# Altium project RF Transceiver.PrjPcb
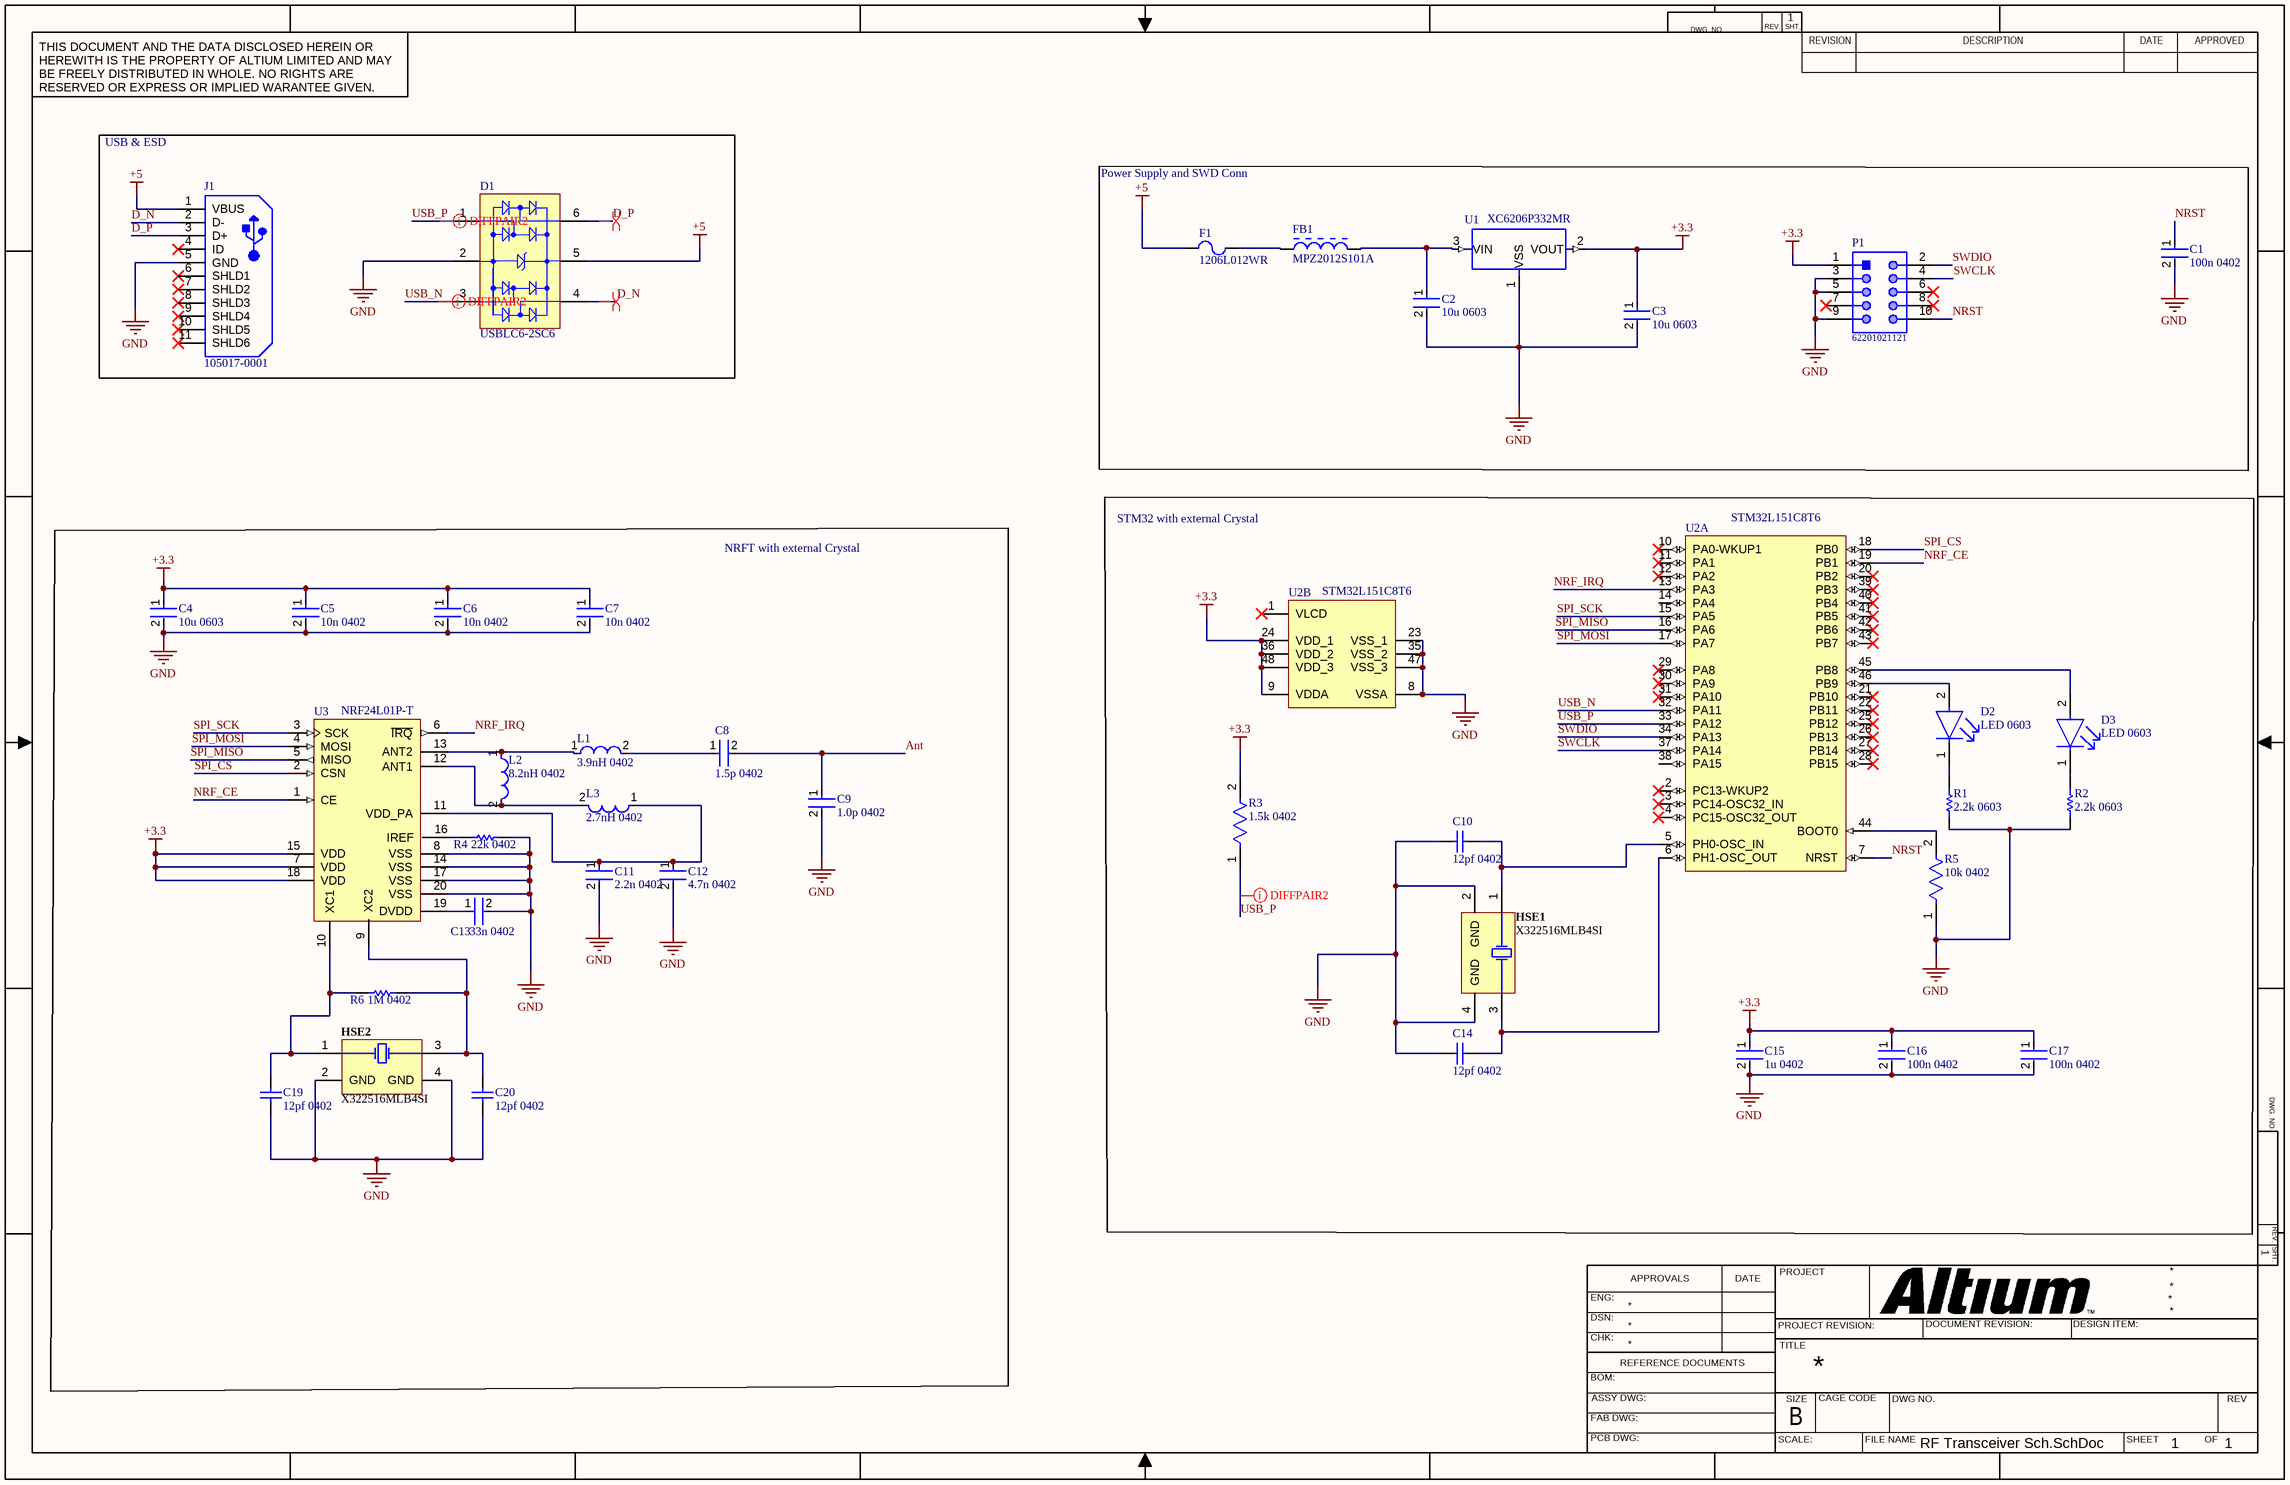
[diagram p0: RF Transceiver Sch.SchDoc]
1 sheet, 40 parts. Net scope: global (net labels, ports and power ports of the same name join across sheets).
Board file: RF Transceiver PCB.PcbDoc

## Sheet RF Transceiver Sch.SchDoc
size 431 x 279 mm; SheetNumber: 1; SheetTotal: 1

### Parts
C1  100n 0402  [FP-C0402-BB-MFG]
C2  10u 0603  [FP-GRM188-0_1-e0_2_0_55-IPC_A]
C3  10u 0603  [FP-GRM188-0_1-e0_2_0_55-IPC_A]
C4  10u 0603  [FP-GRM188-0_1-e0_2_0_55-IPC_A]
C5  10n 0402  [FP-C0402-BB-MFG]
C6  10n 0402  [FP-C0402-BB-MFG]
C7  10n 0402  [FP-C0402-BB-MFG]
C8  1.5p 0402  [FP-C0402-BB-MFG]
C9  1.0p 0402  [FP-C0402-BB-MFG]
C10  12pf 0402  [CAPC1005X55X25ML05T10]
C11  2.2n 0402  [FP-C0402-BB-MFG]
C12  4.7n 0402  [FP-C0402-BB-MFG]
C13  33n 0402  [FP-C0402-BB-MFG]
C14  12pf 0402  [CAPC1005X55X25ML05T10]
C15  1u 0402  [FP-GRM15-0_1-MFG]
C16  100n 0402  [FP-C0402-BB-MFG]
C17  100n 0402  [FP-C0402-BB-MFG]
C19  12pf 0402  [CAPC1005X55X25ML05T10]
C20  12pf 0402  [CAPC1005X55X25ML05T10]
D1  USBLC6-2SC6  [STM-SOT23-6L_V]
D2  LED 0603  [FP-LTST-C191TBKT-MFG]
D3  LED 0603  [FP-LTST-C191TBKT-MFG]
F1  1206L012WR  [LFUS-1206L012WR_V]
FB1  MPZ2012S101A  [TDK-MPZ2012S101A-2_V]
HSE1  X322516MLB4SI  [EPSON-TSX-3225_V]
HSE2  X322516MLB4SI  [EPSON-TSX-3225_V]
J1  105017-0001  [USB-MICRO-B_V]
L1  3.9nH 0402  [FP-LQW15AN_80-MFG]
L2  8.2nH 0402  [FP-LQW15AN_80-MFG]
L3  2.7nH 0402  [FP-LQW15AN_80-MFG]
P1  62201021121  [62201021121]
R1  2.2k 0603  [RESC1609X50X30NL10T20]
R2  2.2k 0603  [RESC1609X50X30NL10T20]
R3  1.5k 0402  [FP-CRCW0402-e3-IPC_B]
R4  22k 0402  [RESC1005X40X25NL05T05]
R5  10k 0402  [FP-CRCW0402-e3-IPC_B]
R6  1M 0402  [RESC1005X40X25NL05T05]
U1  XC6206P332MR  [SOT-23]
U2  STM32L151C8T6  [STM-LQFP48_L]  (parts A,B of 2)
U3  NRF24L01P-T  [NRSC-QFN-20_L]

### Blocks framed on the sheet
USB & ESD: D1 J1
Power Supply and SWD Conn: C1-C3 F1 FB1 P1 U1
NRFT with external Crystal: C4-C9 C11-C13 C19 C20 HSE2 L1-L3 R4 R6 U3
STM32 with external Crystal: C10 C14-C17 D2 D3 HSE1 R1-R3 R5 U2

### Nets
+3.3: C3.1 C4.1 C5.1 C6.1 C7.1 C15.1 C16.1 C17.1 P1.1 R3.2 U1.2(VOUT) U2.9(VDDA) U2.24(VDD_1) U2.36(VDD_2) U2.48(VDD_3) U3.7(VDD) U3.15(VDD) U3.18(VDD)
+5: D1.5(VBUS) F1.1 J1.1(VBUS)
GND: C1.2 C2.2 C3.2 C4.2 C5.2 C6.2 C7.2 C9.2 C10.1 C11.2 C12.2 C13.2 C14.1 C15.2 C16.2 C17.2 C19.1 C20.1 D1.2(GND) HSE1.2(GND) HSE1.4(GND) HSE2.2(GND) HSE2.4(GND) J1.5(GND) P1.3 P1.5 P1.9 R1.2 R2.2 R4.2 R5.1 U1.1(VSS) U2.8(VSSA) U2.23(VSS_1) U2.35(VSS_2) U2.47(VSS_3) U3.8(VSS) U3.14(VSS) U3.17(VSS) U3.20(VSS)
Ant: C8.2 C9.1
D_N: D1.4(I/O_3) J1.2(D-)
D_P: D1.6(I/O_4) J1.3(D+)
NRF_CE: U2.19(PB1) U3.1(CE)
NRF_IRQ: U2.13(PA3) U3.6(~{IRQ})
NRST: C1.1 P1.10 U2.7(NRST)
SPI_CS: U2.18(PB0) U3.2(CSN)
SPI_MISO: U2.16(PA6) U3.5(MISO)
SPI_MOSI: U2.17(PA7) U3.4(MOSI)
SPI_SCK: U2.15(PA5) U3.3(SCK)
SWCLK: P1.4 U2.37(PA14)
SWDIO: P1.2 U2.34(PA13)
USB_N: D1.3(I/O_2) U2.32(PA11)
USB_P: D1.1(I/O_1) R3.1 U2.33(PA12)
NetC2_1: C2.1 FB1.2 U1.3(VIN)
NetC8_1: C8.1 L1.2
NetC10_2: C10.2 HSE1.1(X1) U2.5(PH0-OSC_IN)
NetC11_1: C11.1 C12.1 L3.1 U3.11(VDD_PA)
NetC13_1: C13.1 U3.19(DVDD)
NetC14_2: C14.2 HSE1.3(X2) U2.6(PH1-OSC_OUT)
NetC19_2: C19.2 HSE2.1(X1) R6.1 U3.10(XC1)
NetC20_2: C20.2 HSE2.3(X2) R6.2 U3.9(XC2)
NetD2_1: D2.1(C) R1.1
NetD2_2: D2.2(A) U2.46(PB9)
NetD3_1: D3.1(C) R2.1
NetD3_2: D3.2(A) U2.45(PB8)
NetF1_2: F1.2 FB1.1
NetL1_1: L1.1 L2.1 U3.13(ANT2)
NetL2_2: L2.2 L3.2 U3.12(ANT1)
NetR4_1: R4.1 U3.16(IREF)
NetR5_2: R5.2 U2.44(BOOT0)

Not connected (* = marked no-connect by the designer): J1 4(ID)* 6(SHLD1)* 7(SHLD2)* 8(SHLD3)* 9(SHLD4)* 10(SHLD5)* 11(SHLD6)*; P1 6* 7* 8*; U2 1(VLCD)* 2(PC13-WKUP2)* 3(PC14-OSC32_IN)* 4(PC15-OSC32_OUT)* 10(PA0-WKUP1)* 11(PA1)* 12(PA2)* 14(PA4) 20(PB2)* 21(PB10)* 22(PB11)* 25(PB12)* 26(PB13)* 27(PB14)* 28(PB15)* 29(PA8)* 30(PA9)* 31(PA10)* 38(PA15) 39(PB3)* 40(PB4)* 41(PB5)* 42(PB6)* 43(PB7)*

### Layout directives
differential pair; differential pair class D: D_N, D_P
differential pair; differential pair class D2: USB_N, USB_P

### Notes on the sheet
- DWG. NO.
- REV.
- SHT.
- THIS DOCUMENT AND THE DATA DISCLOSED HEREIN OR HEREWITH IS THE PROPERTY OF ALTIUM LIMITED AND MAY BE FREELY DISTRIBUTED IN WHOLE. NO RIGHTS ARE RESERVED OR EXPRESS OR IMPLIED WARANTEE GIVEN.
- REVISION
- DESCRIPTION
- DATE
- APPROVED
- ENG:
- APPROVALS
- PROJECT
- DSN:
- CHK:
- REFERENCE DOCUMENTS
- PROJECT REVISION:
- TITLE
- DOCUMENT REVISION:
- DESIGN ITEM:
- BOM:
- FAB DWG:
- PCB DWG:
- ASSY DWG:
- SCALE:
- SIZE
- B
- CAGE CODE
- FILE NAME
- DWG NO.
- SHEET
- OF
- REV

### Library data of the parts
C1 C5-C9 C11-C13 C16 C17 = CMP-2008-02046-2: CAP CER 0.1UF 10V X5R 0402; Manufacturer: Kemet; Manufacturer Part Number: C0402C104K8PACTU; Material: Ceramic; Capacitance: 0.10 μF; Temperature Coefficient: 15%; Tolerance: 0.1; Value: 0.10 μF; Package: C0402-BB; Temperature: -55°C to +125°C; ComponentLink2Description: Datasheet; Temperature Characteristic: X5R; Device Class L1: Passive Components; Height: 0.55mm; Lead Free: Yes; ComponentLink2URL: https://content.kemet.com/datasheets/KEM_C1002_X7R_SMD.pdf; Device Class L2: Capacitors; Temperature Range Low: -55°C; Temperature Range High: +125°C; RoHS: TRUE; Octopart: https://octopart.com/c0402c104k8pactu-kemet-140039; Automotive: No; Mouser Description: Capacitor 100 nF 10 VDC 0402; Category: Cap; Voltage Rating: 10 V; Digikey Description: CAP CER 0.1UF 10V X5R 0402; Ipc Land Pattern Name: CAPC10050X50; Device Class L3: Ceramic Capacitors
C2-C4 = CMP-2006-02792-2: Chip Multilayer Ceramic Capacitors for General Purpose, 0603, 10uF, X5R, 15%, 20%, 6.3V; Packaging: Tape and Reel; Voltage Rating (DC): 6.3V; Width: 0.031inch; Termination: SMD/SMT; Dielectric: X5R; Package Quantity: 4000; Voltage Rating: 6.3V; Capacitance: 10uF; Case/Package: 0603; Min Operating Temperature: -55°C; Voltage: 6.3V; Length: 1.6mm; Thickness: 0.035inch; Lead Free: Lead Free; Depth: 0.8mm; Case Code (Imperial): 0603; Max Operating Temperature: 85°C; Material: Ceramic; Height: 0.8mm; Tolerance: 20%; Mount: Surface Mount; REACH SVHC: No SVHC; Radiation Hardening: No; Case Code (Metric): 1608
C10 C14 C19 C20 = CMP-2008-03945-1: Part Number: GRM1555C1H120GA01D; Manufacturer: Murata
C15 = CMP-2008-04556-2: CAP CER 1UF 10V X5R 0402; Manufacturer Part Number: GRM155R61A105KE15D; Manufacturer: Murata; Material: Ceramic; Tolerance: 10%; Temperature Coefficient: 15%; Octopart: https://octopart.com/grm155r61a105ke15d-murata-197442; Lead Free: Yes; ComponentLink2Description: Datasheet; Temperature: -55°C to +85°C; Temperature Range High: +85°C; Height: 0.55mm; Capacitance: 1uF; Ipc Land Pattern Name: CAPC10050X50; ComponentLink2URL: https://search.murata.co.jp/Ceramy/image/img/A01X/G101/ENG/GRM155R61A105KE15-01A.pdf; Temperature Range Low: -55°C; Device Class L2: Capacitors; Voltage Rating: 10V; RoHS: TRUE; Device Class L1: Passive Components; Device Class L3: Ceramic Capacitors; Temperature Characteristic: X5R; Mouser Description: 0402 1 uF 10 V ±10% Tolerance X5R Surface Mount Multilayer Ceramic Capacitor; Automotive: No; Package: GRM15-0.1; Digikey Description: CAP CER 1UF 10V X5R 0402; Value: 1uF; Category: Cap
D1 = CMP-2000-05378-1: Very low capacitance ESD protection, 3.5 pF, -40 to 125 degC, 6-Pin SOT23, RoHS, Tape and Reel; Manufacturer: STMicroelectronics; Polarity: Uni-Directional; Clamping Voltage: 17V; Rad Hardened: No; Product Height (mm): 1.3mm; Leakage Current (Max): 0.15uA; Product Length (mm): 3.05mm; Number of Elements: 1; Peak Pulse Current: 5A; Configuration: Dual; Reverse Breakdown Voltage: 6V; Working Voltage (Max): 5V; Capacitance Value: 3.5pF; Suppressor Type: DiodeArrays; Product Depth (mm): 1.75mm; Test Current (It): 1mA; Package / Case: SOT-23; Operating Temperature Max Deg. C: 125C; Package Description: 6-Pin Small Outline Transistor, Body 2.925 x 1.625 mm, Pitch 0.95 mm; Package Reference: SOT23-6L; Datasheet Version: Rev. 5, 10/2011; Operating Temperature Min Deg. C: -40C; Mounting Style: SurfaceMount; Direction Type: Uni-Directional; Mounting: SurfaceMount; Pin Count: 6; Leakage Current: 0.15uA; Packaging: TapeandReel; Operating Temperature Classification: Automotive; Clamping Voltage (Max): 17V; Manufacturer URL: http://www.st.com/; Reverse Stand-off Voltage: 5V; Datasheet URL: http://www.st.com/st-web-ui/static/active/en/resource/technical/document/datasheet/CD00050750.pdf; Working Voltage: 5V; Operating Temp Range: -40Cto125C
D2 D3 = CMP-22017-000008-1: LED BLUE CLEAR CHIP SMD; Lens Color: Colorless; Dominant Wavelength: 475nm; Forward Current: 20mA; Wavelength: 468nm; Viewing Angle: 130°; Power Dissipation: 76mW; Luminous Intensity: 180mcd; Reverse Voltage: 5V; Number of Elements: 1; Lens Style: Diffused; Forward Voltage: 3.8V; Max Power Dissipation: 75mW; Case Code (Metric): 1608; Packaging: Tape and Reel; Case/Package: 0603; Depth: 1.6mm; Mount: Surface Mount; Lead Free: Lead Free; Min Operating Temperature: -20°C; Lens Transparency: Clear; Illumination Color: Blue; Height: 0.55mm; Test Current: 20mA; Case Code (Imperial): 0603; Max Operating Temperature: 80°C; Number of Pins: 2; Length: 0.8mm; Radiation Hardening: No; Package Quantity: 1; Number of LEDs: 1; Width: 0.8mm; Color: Blue
F1 = CMP-2000-05470-1: POLY-FUSE(R) Resettable PTC, 30 V, -40 to 85 degC, 2-Pin SMD, RoHS, Tape and Reel; Manufacturer: Littelfuse; Hold Current [Ih]: 0.125A; Working Voltage-Max: 30V; Trip Current: 0.29A; Operating Temp Range: -40to+85°C; Package Reference: 1206; Package Description: 2-Pin Surface Mount Device, Body 3.2 x 1.65 mm; Mounting Technology: SurfaceMount; Manufacturer URL: http://www.littelfuse.com/; Datasheet URL: https://datasheet.ciiva.com/26787/1206l012wr-26787215.pdf; Size: 1206; Datasheet Version: 04/2012
FB1 = CMP-2000-05399-1: Chip Bead for Power Line, 100 Ohm, +/- 25%, 4 A, -55 to 125 degC, 0805 (2012 Metric), RoHS, Tape and Reel; Manufacturer: TDK; Maximum DC Resistance: 20mOhms; Test Frequency: 100MHz; Impedance: 100Ohms; Case Width: 1.25mm; Case Length: 2mm; Maximum DC Current: 4A; Case Height: 0.85mm; Package Reference: MPZ2012S101A-2; RoHS: Details; Tolerance: 25%; Operating Temperature Range: -55Cto+125C; Datasheet Version: Jul-13; Dimensions: 1.25mmWx2mmLx0.85mmH; Product: FerriteChipBeads; Termination Style: SMD/SMT; Datasheet URL: http://www.farnell.com/datasheets/1750041.pdf; Factory Pack Quantity: 4000; Brand: TDK; Packaging: Reel; Package Description: 2-Pin Surface Mount Device, Body 2 x 1.25 mm; Product Category: EMIFilterBeads,Chips&Arrays; Manufacturer URL: http://www.tdk.com/; Package / Case: 0805(2012metric)
HSE1 HSE2 = CMP-2000-07331-1: Crystal, 16 MHz, -40 to 85 degC, 4-Pin SMD, RoHS, Tape and Reel; Manufacturer: Epson; ESR: 60Ohms; Brand: EpsonTiming; Load Capacitance: 9pF; Frequency: 16MHz; Frequency Stability: 10PPM; Unit Weight: 0.000564oz; Drive Level: 200uW; Factory Pack Quantity: 250; Mounting Style: SMD/SMT; Packaging: Reel; Datasheet URL: https://support.epson.biz/td/api/doc_check.php?dl=brief_FA-238V_en.pdf; Datasheet Version: 12/2015; Package Reference: TSX-3225; Series: TSX-3225; Package / Case: 3.2mmx2.5mm; Package Description: 4-Pin Surface Mount Device, Body 3.2 x 2.5 mm; Type: Crystal; Height: 0.6mm; Manufacturer URL: https://www.eea.epson.com/; Operating Temperature Range: -20Cto+75C; Length: 3.2mm; Width: 2.5mm; RoHS: True; Mounting Technology: SurfaceMount; Termination Style: SMD/SMT; Product Category: Crystals; Tolerance: 10PPM
J1 = CMP-2000-05827-1: Micro-USB B Receptacle, Right Angle, Bottom Mount, Surface Mount, with Solder Tabs, -30 to 85 degC, 5-Pin USB, RoHS, Tape and Reel; Manufacturer: Molex; Featured Product: Micro-USBConnectorsUSBConnectors; Other Names: WM1399DKR; Package Version: Rev. F, 12/2012; Number of Contacts: 5; Connector Type: USB-microB; Catalog Drawings: 1050170001; 3D Model: 105017-0001.stp; Mating Products: WM17145-ND-CABLEMICROUSBBTOSTDA1.0MWM17147-ND-CABLEMICROUSBBTOSTDA2.0MWM17146-ND-CABLEMICROUSBBTOSTDA1.5M; PCN Assembly/Origin: ResinSupplier21/Oct/2015; Voltage - Max: 30V; Online Catalog: Molex-MicroUSB; Manufacturer URL: http://www.molex.com/; Package Description: 5-Leads USB, Micro B, Body 7.5 x 5 mm, Pitch 0.65 mm; Datasheet URL: http://www.molex.com/elqNow/elqRedir.htm?ref=http://www.molex.com/webdocs/datasheets/pdf/en-us/1050170001_IO_CONNECTORS.pdf; Ingress Protection: -; Datasheet Version: 03/2016; Mounting Type: BoardCutout,SurfaceMount,RightAngle; Circuits: 5; Standard Package: 1; Package Reference: MICRO-B; Package URL: http://www.molex.com/pdm_docs/sd/1050170001_sd.pdf; Category: Connectors,Interconnects; Series: -; RoHS Information: 1050170001CertofCompliance; Features: Shielded,SolderRetention; Family: USB,DVI,HDMIConnectors; Specifications: -; Gender: Receptacle; Packaging: Digi-Reel®; Mounting Technology: SurfaceMount
L1-L3 = CMP-06042-006817-1: Wire Wound RF Inductor for Automotive 3.4nH ±0.5nH 1950mA 0.03Ω 0402 (1005)
P1 = CMP-1502-00948-1: THT Vertical Pin Header WR-PHD, Pitch 1.27 mm, Dual Row, 10 pins; Manufacturer: Wurth Elektronik; Rated Current: 1A; Pin Number: 10; Working Voltage: 100VAC; Contact Resistance: 20mOhm; Withstanding Voltage: 500VAC; Pitch: 1.27mm; Gender: Male; Mounting Technology: THT; Manufacturer URL: http://www.we-online.de; Package Reference: 62201021121; Row Number: Dual; Datasheet URL: https://katalog.we-online.de/em/datasheet/62201021121.pdf; Publisher: WurthElektronik; Packaging: Box; Operating Temperature: -40to105degC; Orientation: Vertical; Part Number: 62201021121
R1 R2 = CMP-2000-03167-1: Part Number: CRCW06032K20FKEA; Manufacturer: Vishay Dale
R3 R5 = CMP-2002-08135-2: RES SMD 10K OHM 1% 1/16W 0402; Power Rating: 63mW; Resistance: 10kR; Voltage Rating: 50V; Temperature Coefficient: 100ppm/°C; Case Code (Metric): 1005; Features: Automotive AEC-Q200; Termination: SMD/SMT; Mount: Surface Mount; Package Quantity: 10; Packaging: Tape and Reel; Case Code (Imperial): 0402; Weight: 2.3E-05oz; Lead Free: Lead Free; Width: 0.02inch; Max Power Dissipation: 63mW; Tolerance: 1%; Number of Terminations: 2; Height: 0.35mm; Number of Pins: 2; Composition: Thick Film; Length: 1mm; Voltage Rating (DC): 50V; Case/Package: 0402; Radiation Hardening: No; Contact Plating: Tin; Depth: 0.5mm; Military Standard: Not; Min Operating Temperature: -55°C; Max Operating Temperature: 155°C
R4 R6 = CMP-1011-00659-2: Part Number: CRCW040222K0FKED; Manufacturer: Vishay Dale
U1 = PMIC-LDO-XC6206P332MR-G(SOT23): Linear Voltage Regulator IC 1 Output 200mA SOT-23; MF: Torex; Availability: Unavailable; Price: None; Package: SOT-23-3 Torex; Value: *; SnapEDA_Link: https://www.snapeda.com/parts/XC6206P332MR-G/Torex/view-part/105716/?ref=snap; MP: XC6206P332MR-G
U2 = CMP-0236-00023-4: ARM Cortex-M3 32-bit MCU, 64 KB Flash, 10 KB Internal RAM, 37 I/Os, 48-pin LQFP, -40 to 85 degC, Tray; Internal RAM Size (kB): 10; Supply Voltage(Vcc) min (V): 1.65; I/Os (High Current): 37; D/A Converter: 2x12-bit (2 Channel); Operating Frequency(F) (Processor speed) (MHz): 32; FLASH Size (Prog) (kB): 64; Data E2PROM nom (B): 4096; Core: ARM Cortex-M3; PackageDescription: 48-Pin Low Profile Quad Flat Package, 7 x 7 mm Body, 0.5 mm Pitch; PackageReference: LQFP48; ComponentLink2Description: Datasheet; PackageVersion: Rev. 6, 06/2013; ComponentLink1URL: http://www.st.com/web/en/home.html; Packing: Tray; PartNumber: STM32L151C8T6; ComponentLink2URL: http://www.st.com/st-web-ui/static/active/en/resource/technical/document/datasheet/CD00277537.pdf; ComponentLink3Description: Package Specification; ComponentLink1Description: Manufacturer URL; DatasheetVersion: Rev. 8; Mounting Technology: Surface Mount; ComponentLink3URL: http://www.st.com/st-web-ui/static/active/en/resource/technical/document/datasheet/DM00058181.pdf
U3 = CMP-2000-06859-1: Single Chip Transceiver, 2.4 GHz, 60 mW, 1.9 to 3.6 V, -40 to 85 degC, 20-Pin QFN, RoHS, Tray; Manufacturer: Nordic Semiconductor; Data Rate (Max): 2Mbps; Current - Transmitting: 7mA~11.3mA; Power - Output: 0dBm; Other Names: 1490-1019; Online Catalog: nRF24L01+; Current - Receiving: 12.6mA~13.5mA; For Use With: 1490-1002-ND-KITEVALUATIONNRF24L01P1568-1295-ND-SPARKFUNTRANSCEIVERBREAKOUT-1568-1296-ND-SPARKFUNTRANSCEIVERBREAKOUT-1471-1410-ND-DEVBOARDNRFSCLICKNRF24L01P-MODULE-PCB-ND-KITEVALNRF24L01+PCBANTENNANRF24L01P-MODULE-SMA-ND-KITEVALNRF24L01+SMACONNNRF24L01P-UPGRADE-ND-UPGRADE2PCB/1SMANRF24L01103990038-ND-DEVDUINOSENSORNODEV1.3103990053-ND-DEVDUINOSENSORNODEV2(ATMEGA103990074-ND-DEVDUINOSENSORNODE106990026-ND-ENERGYMONITORSHIELDV2113990088-ND-WIRELESSGATESHIELD113990095-ND-DEVDUINOSENSORNODEV3(ATMEGA106030001-ND-ENERGYMONITORSHIELD1597-1361-ND-DEVDUINOSENSORNODEV2.2(ATMEG105990030-ND-RGBWSTRIPWIRELESSSHIELDV1.0; Frequency: 2.4GHz; Design Resources: DevelopmentToolSelector; RF Family/Standard: GeneralISM>1GHZ; Serial Interfaces: SPI; Sensitivity: -94dBm; Voltage - Supply: 1.9V~3.6V; Modulation: GFSK; GPIO: -; Package Reference: QFN20; Memory Size: -; Category: RF/IFandRFID; Type: TxRxOnly; Standard Package: 490; Package / Case: 20-VFQFNExposedPad; Packaging: Tray; Series: -; Package Description: 20-Pin Quad Flat No-lead Package, Body 4 x 4 mm, Pitch 0.5 mm; Datasheet Version: Rev. 1.0, 09/2008; Protocol: -; Manufacturer URL: http://www.nordicsemi.com/eng/Products/; Operating Temperature: -40°C~85°C; Family: RFTransceiverICs; Datasheet URL: http://www.nordicsemi.com/eng/content/download/2726/34069/file/nRF24L01P_Product_Specification_1_0.pdf; Mounting Technology: SurfaceMount